# Altium schematic sheet PWM_CONTROLLER_nverter_540VDC_V2.SchDoc
size A0; SheetNumber: 1; SheetTotal: 1; SPICEModelCacheYQEDCYZF: <root> / <DocumentId>YQEDCYZF</DocumentId> / <CacheFrame Number="0"> / <Model Name="7850_74477530_1m" Kind="CKT"> / <Text>******* / .subckt 7850_74477530_1m 1 2 / Rp 1 2 187304.915771 / Cp 1 2 4.36976277949p / Rs 1 N3 3.3 / L1 N3 2 1000u / .ends 7850_74477530_1m</Text> / </Model> / </CacheFrame> / </root>
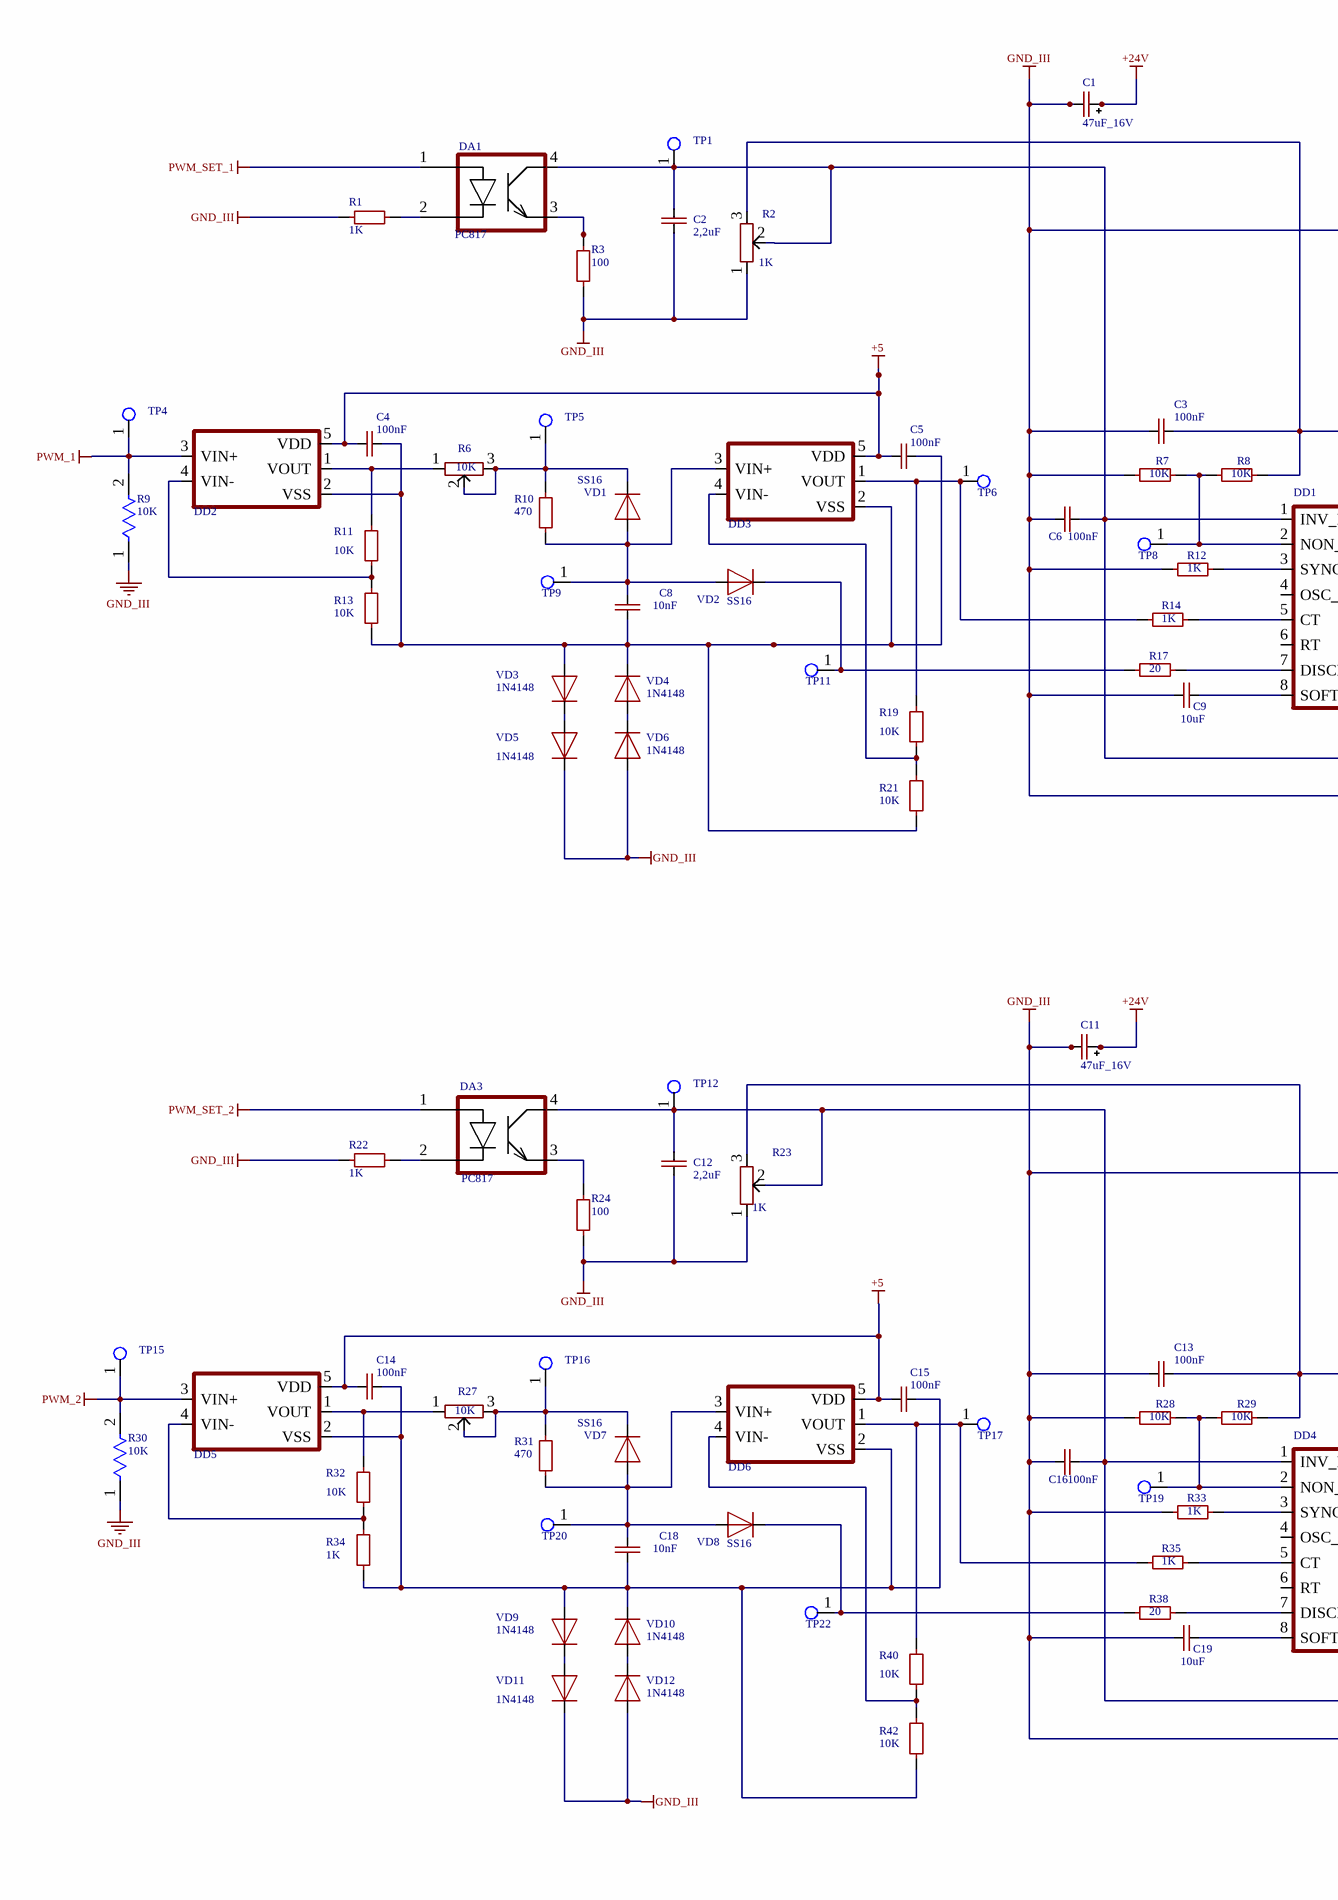
[diagram p0: PWM_CONTROLLER_nverter_540VDC_V2.SchDoc, top left]
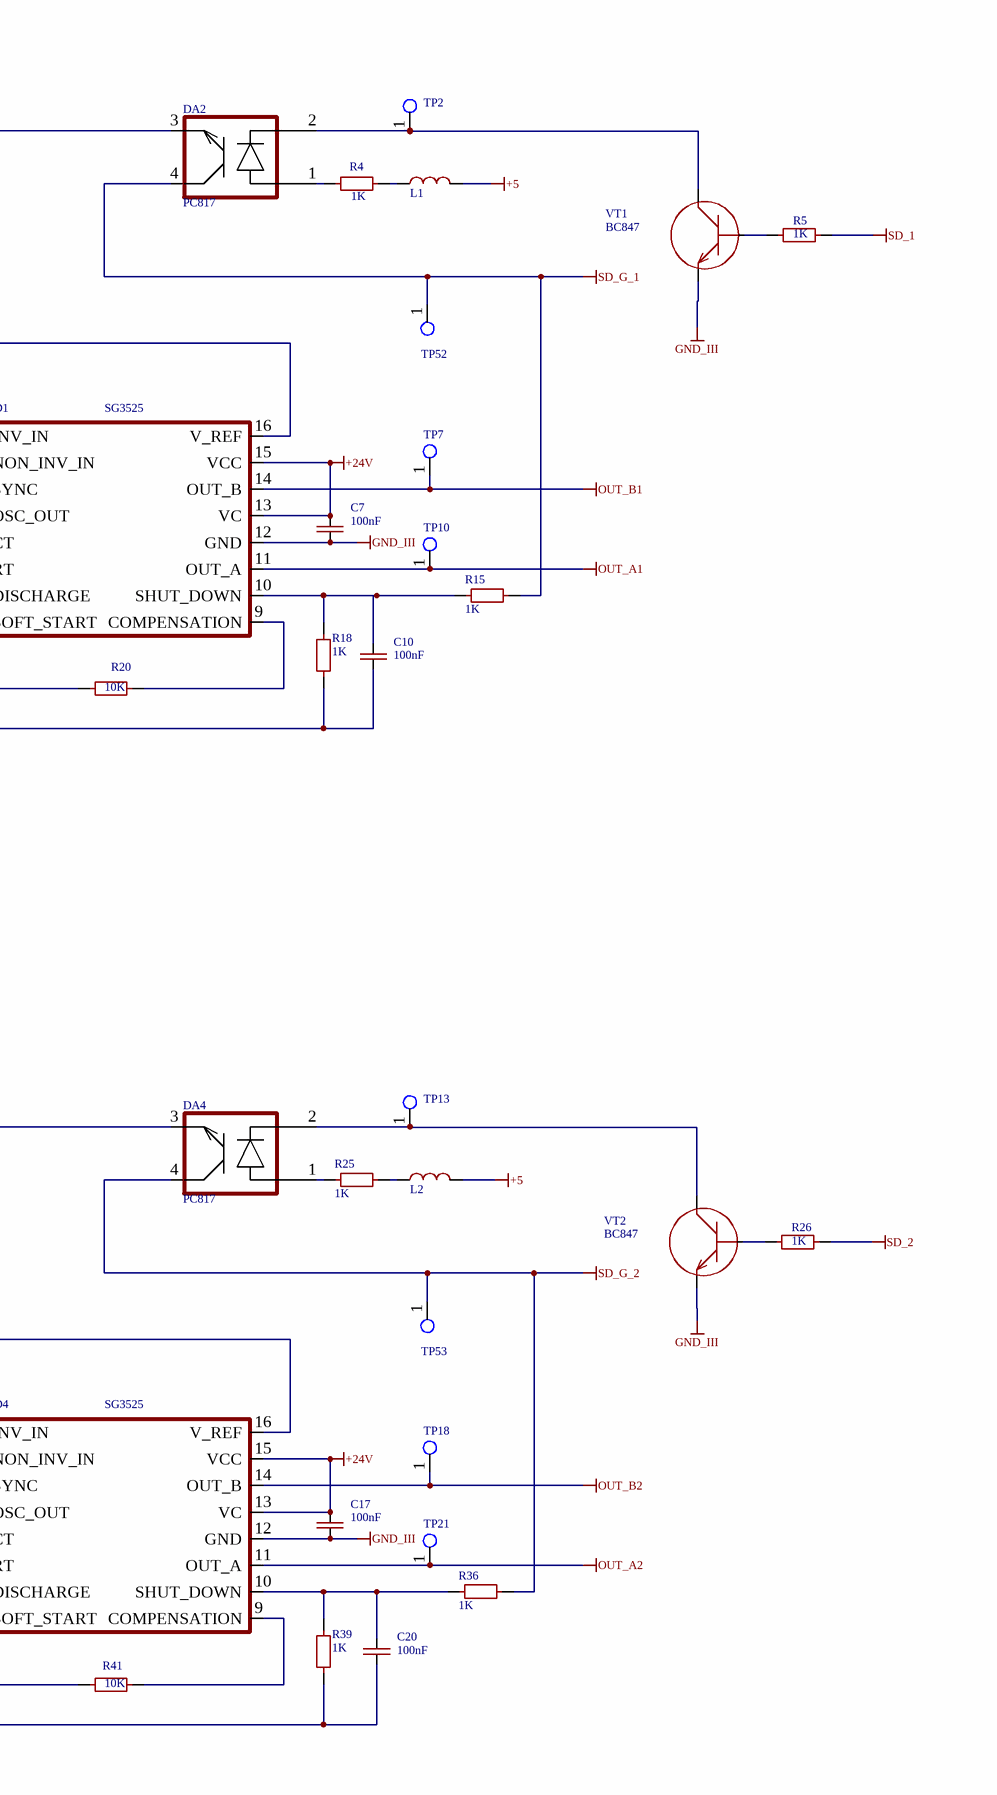
[diagram p1: PWM_CONTROLLER_nverter_540VDC_V2.SchDoc, top right]
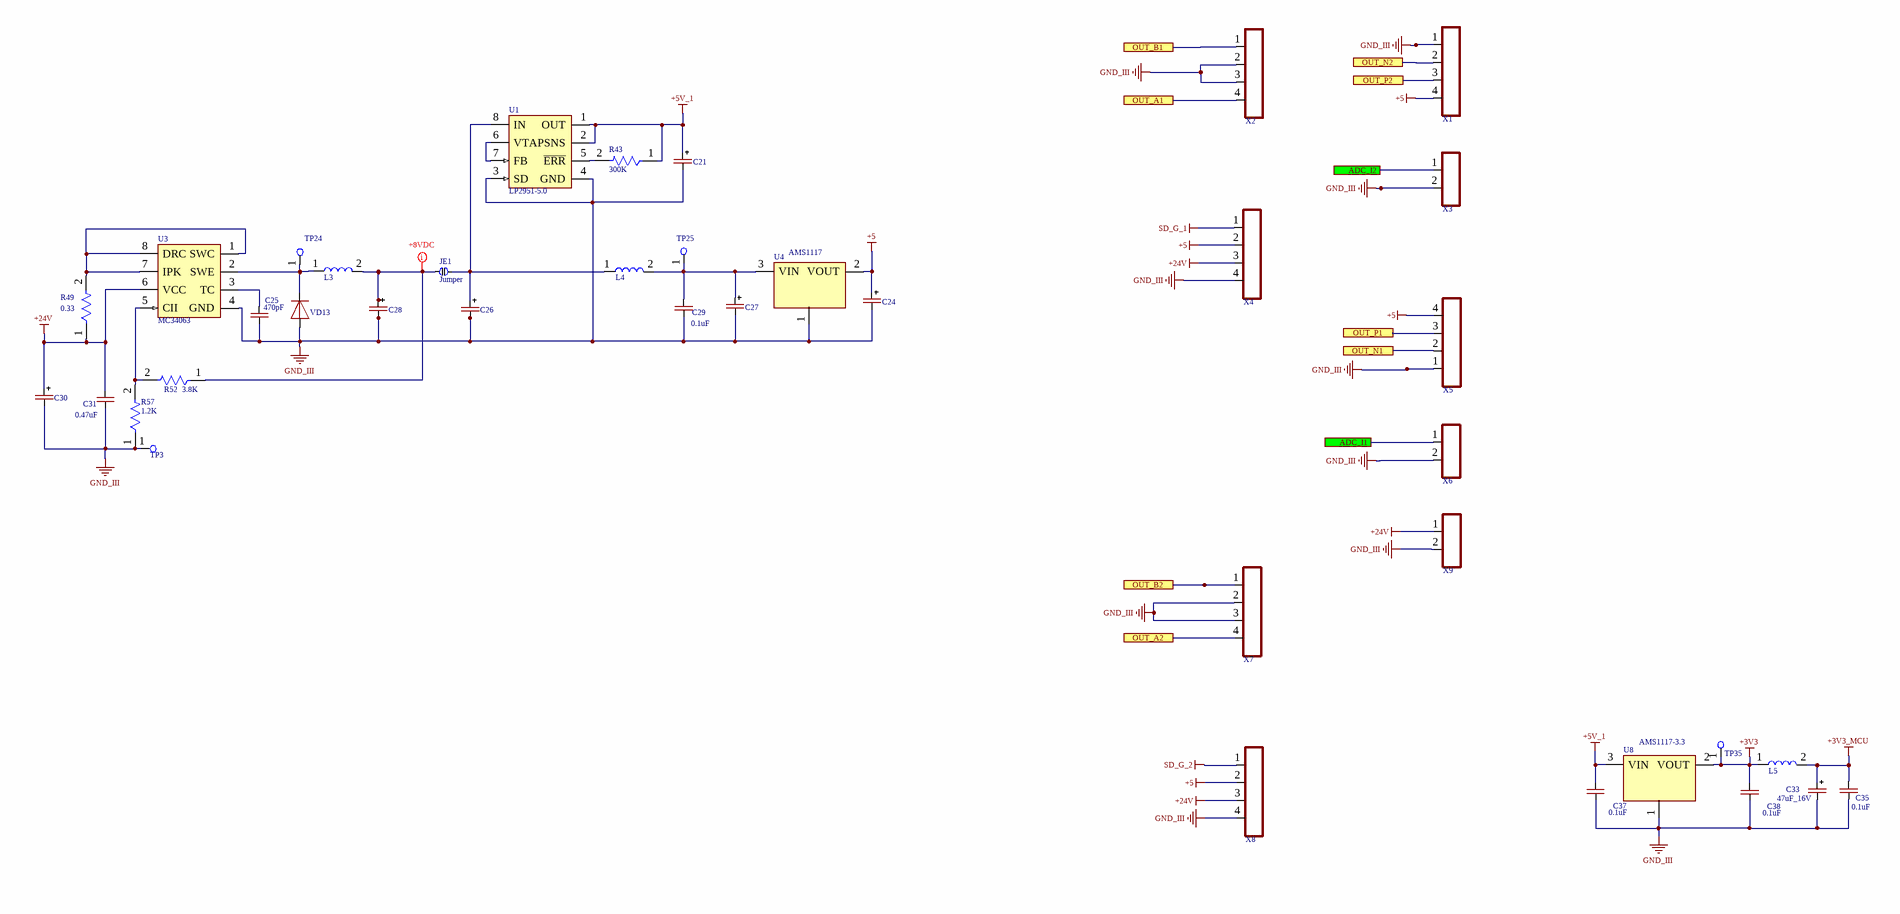
[diagram p2: PWM_CONTROLLER_nverter_540VDC_V2.SchDoc, bottom left]
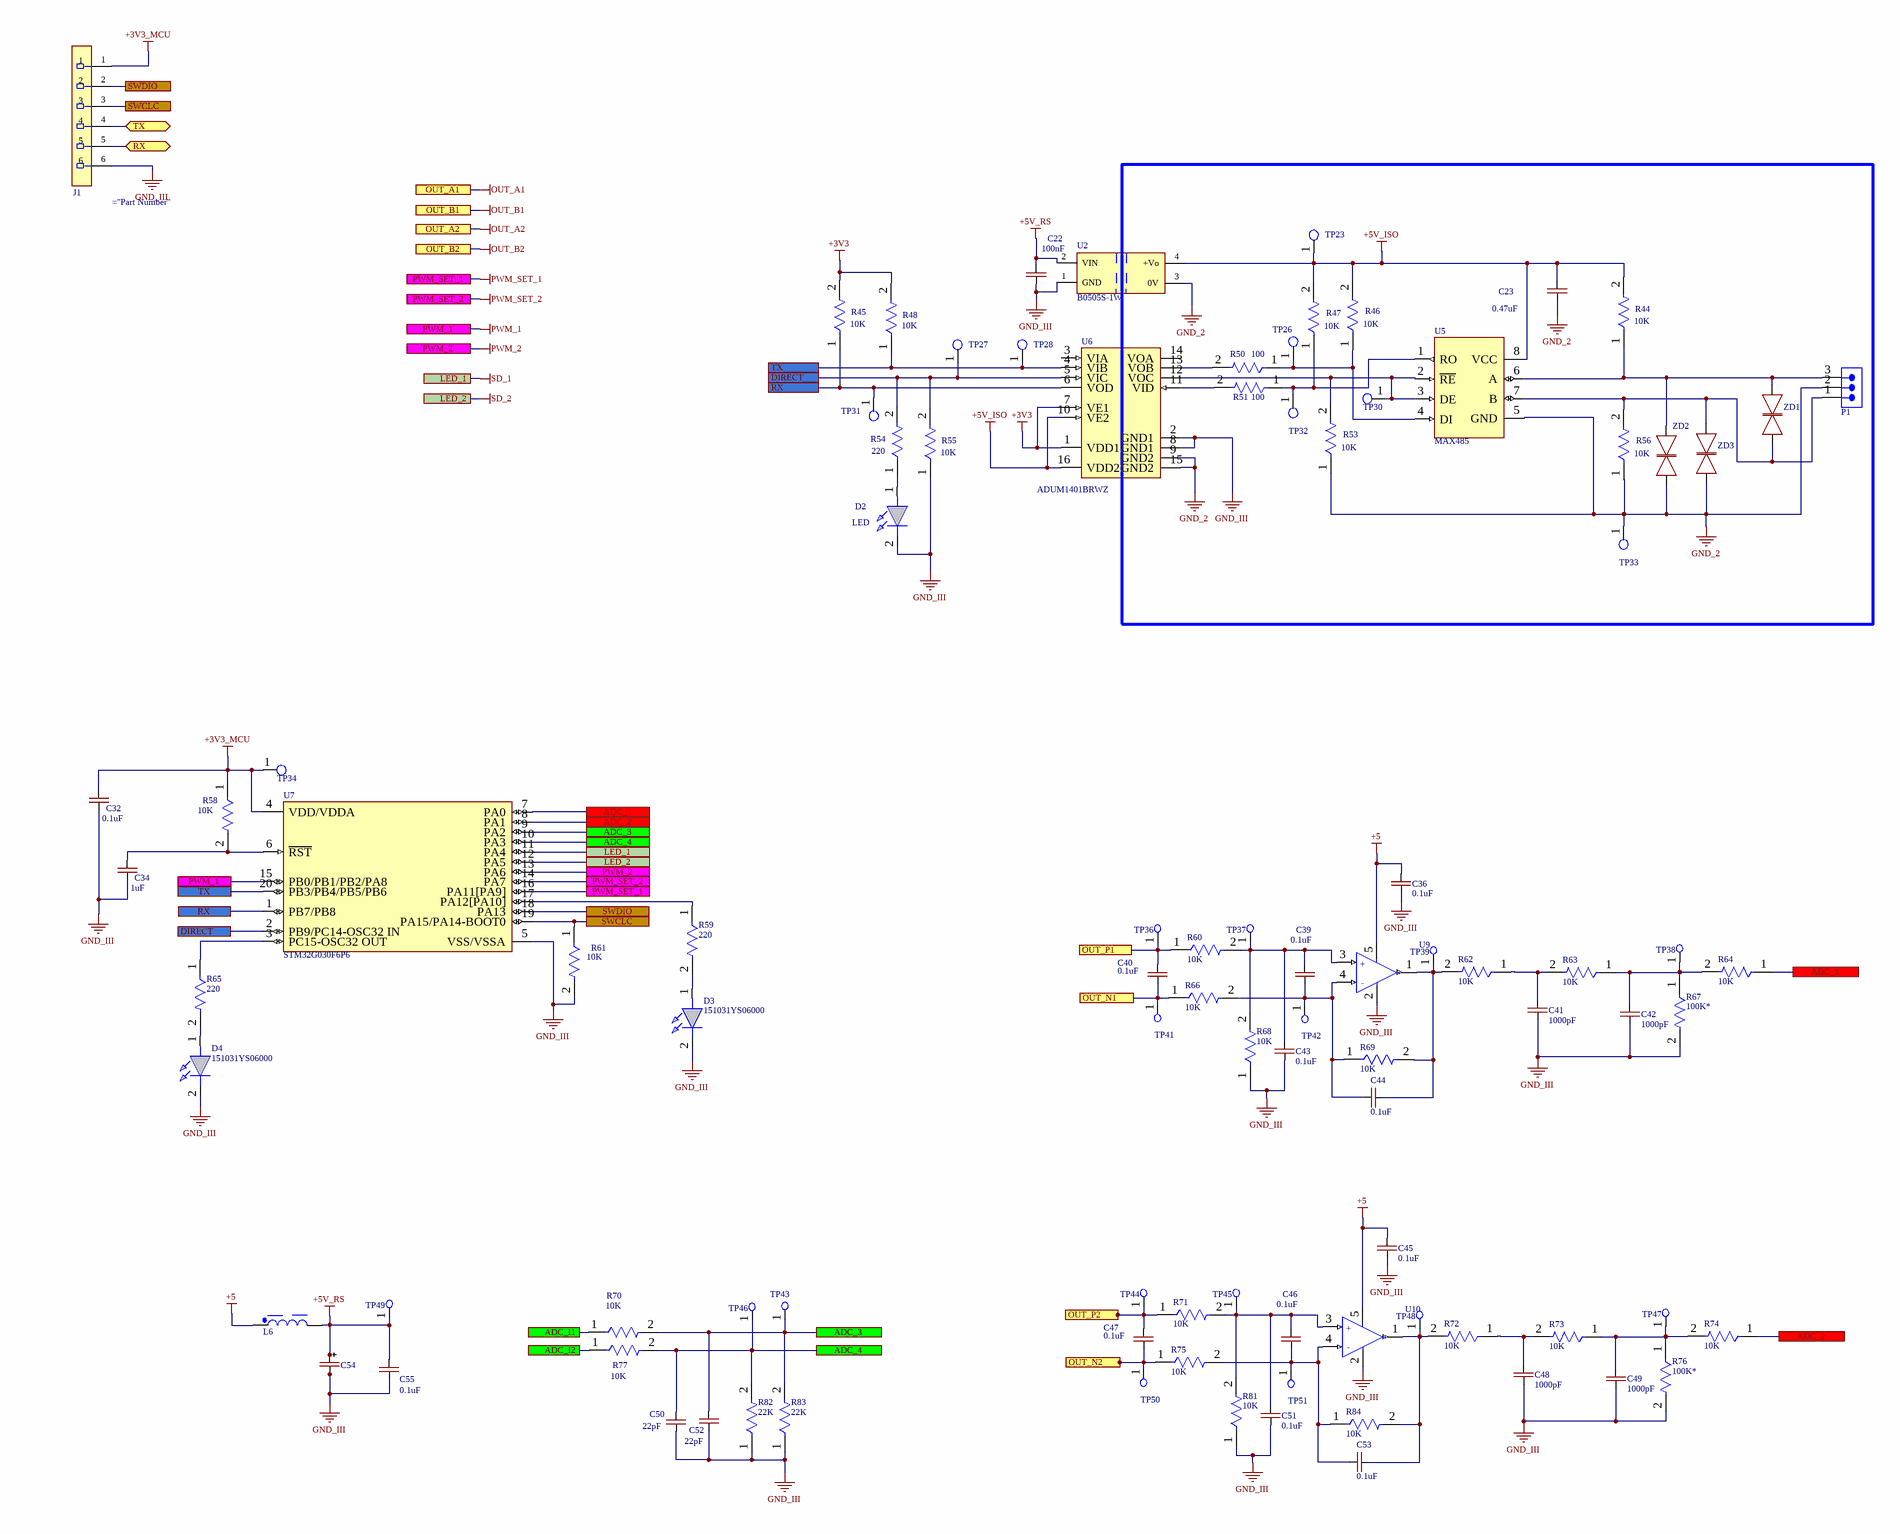
[diagram p3: PWM_CONTROLLER_nverter_540VDC_V2.SchDoc, bottom right]

## Parts
C1  47uF_16V  [CAP-TAN-D]
C2  2,2uF  [CAP-0805]
C3  100nF  [CAP-0805]
C4  100nF  [CAP-0805]
C5  100nF  [CAP-0805]
C6  100nF  [CAP-0805]
C7  100nF  [CAP-0805]
C8  10nF  [CAP-0805]
C9  10uF  [CAP-0805]
C10  100nF  [CAP-0805]
C11  47uF_16V  [CAP-TAN-D]
C12  2,2uF  [CAP-0805]
C13  100nF  [CAP-0805]
C14  100nF  [CAP-0805]
C15  100nF  [CAP-0805]
C16  100nF  [CAP-0805]
C17  100nF  [CAP-0805]
C18  10nF  [CAP-0805]
C19  10uF  [CAP-0805]
C20  100nF  [CAP-0805]
C21  CAP-POLAR  [CAP-TAN-C]  (value not drawn)
C22  100nF  [CAP-0805]
C23  0.47uF  [CAP-0805]
C24  CAP-POLAR  [CAP-TAN-C]  (value not drawn)
C25  470pF  [CAP-0805]
C26  CAP-POLAR  [CAP-TAN-C]  (value not drawn)
C27  CAP-POLAR  [CAP-TAN-C]  (value not drawn)
C28  CAP-POLAR  [CAP-TAN-C]  (value not drawn)
C29  0.1uF  [CAP-0805]
C30  CAP-POLAR  [CAP-TAN-C]  (value not drawn)
C31  0.47uF  [CAP-0805]
C32  0.1uF  [CAP-0805]
C33  47uF_16V  [CAP-TAN-D]
C34  1uF  [CAP-0805]
C35  0.1uF  [CAP-0805]
C36  0.1uF  [CAP-0805]
C37  0.1uF  [CAP-0805]
C38  0.1uF  [CAP-0805]
C39  0.1uF  [CAP-0805]
C40  0.1uF  [CAP-0805]
C41  1000pF  [CAP-0805]
C42  1000pF  [CAP-0805]
C43  0.1uF  [CAP-0805]
C44  0.1uF  [CAP-0805]
C45  0.1uF  [CAP-0805]
C46  0.1uF  [CAP-0805]
C47  0.1uF  [CAP-0805]
C48  1000pF  [CAP-0805]
C49  1000pF  [CAP-0805]
C50  22pF  [CAP-0805]
C51  0.1uF  [CAP-0805]
C52  22pF  [CAP-0805]
C53  0.1uF  [CAP-0805]
C54  CAP-POLAR  [CAP-TAN-C]  (value not drawn)
C55  0.1uF  [CAP-0805]
D2  LED  [LED_RED]
D3  151031YS06000  [LED_RED]
D4  151031YS06000  [LED_RED]
DA1  PC817  [4-SMD]
DA2  PC817  [4-SMD]
DA3  PC817  [4-SMD]
DA4  PC817  [4-SMD]
DD1  SG3525  [SO16-150]
DD2  MCP6001  [SOT23-5]  (value not drawn)
DD3  MCP6001  [SOT23-5]  (value not drawn)
DD4  SG3525  [SO16-150]
DD5  MCP6001  [SOT23-5]  (value not drawn)
DD6  MCP6001  [SOT23-5]  (value not drawn)
J1  SWR25X-NRTC-S06-ST-BA  [Sullins_SWR25X-NRTC-S06-ST-BA_MFG]  (value not drawn)
JE1  Jumper  [JE]
L1  IND-CONST  [IND-5852]  (value not drawn)
L2  IND-CONST  [IND-5852]  (value not drawn)
L3  Coil  [Coil_4.5x4.5_mm]  (value not drawn)
L4  Coil  [Coil_4.5x4.5_mm]  (value not drawn)
L5  Coil  [Coil_4.5x4.5_mm]  (value not drawn)
L6  1000µH, 0.3A  [WE-PD2_7850]  (value not drawn)
P1  691701530003B  [691701530003B]  (value not drawn)
R1  1K  [RES-0805]
R2  1K  [3296W]
R3  100  [RES-0805]
R4  1K  [RES-0805]
R5  1K  [RES-0805]
R6  10K  [3296W]
R7  10K  [RES-0805]
R8  10K  [RES-0805]
R9  10K  [RES-0805]
R10  470  [RES-0805]
R11  10K  [RES-0805]
R12  1K  [RES-0805]
R13  10K  [RES-0805]
R14  1K  [RES-0805]
R15  1K  [RES-0805]
R17  20  [RES-0805]
R18  1K  [RES-0805]
R19  10K  [RES-0805]
R20  10K  [RES-0805]
R21  10K  [RES-0805]
R22  1K  [RES-0805]
R23  1K  [3296W]
R24  100  [RES-0805]
R25  1K  [RES-0805]
R26  1K  [RES-0805]
R27  10K  [3296W]
R28  10K  [RES-0805]
R29  10K  [RES-0805]
R30  10K  [RES-0805]
R31  470  [RES-0805]
R32  10K  [RES-0805]
R33  1K  [RES-0805]
R34  1K  [RES-0805]
R35  1K  [RES-0805]
R36  1K  [RES-0805]
R38  20  [RES-0805]
R39  1K  [RES-0805]
R40  10K  [RES-0805]
R41  10K  [RES-0805]
R42  10K  [RES-0805]
R43  300K  [RES-0805]
R44  10K  [RES-0805]
R45  10K  [RES-0805]
R46  10K  [RES-0805]
R47  10K  [RES-0805]
R48  10K  [RES-0805]
R49  0.33  [RES-1206]
R50  100  [RES-0805]
R51  100  [RES-0805]
R52  3.8K  [RES-0805]
R53  10K  [RES-0805]
R54  220  [RES-0805]
R55  10K  [RES-0805]
R56  10K  [RES-0805]
R57  1.2K  [RES-0805]
R58  10K  [RES-0805]
R59  220  [RES-0805]
R60  10K  [RES-0805]
R61  10K  [RES-0805]
R62  10K  [RES-0805]
R63  10K  [RES-0805]
R64  10K  [RES-0805]
R65  220  [RES-0805]
R66  10K  [RES-0805]
R67  100K*  [RES-0805]
R68  10K  [RES-0805]
R69  10K  [RES-0805]
R70  10K  [RES-0805]
R71  10K  [RES-0805]
R72  10K  [RES-0805]
R73  10K  [RES-0805]
R74  10K  [RES-0805]
R75  10K  [RES-0805]
R76  100K*  [RES-0805]
R77  10K  [RES-0805]
R81  10K  [RES-0805]
R82  22K  [RES-0805]
R83  22K  [RES-0805]
R84  10K  [RES-0805]
TP1  Test_Point_PCB  [Test_Point]  (value not drawn)
TP2  Test_Point_PCB  [Test_Point]  (value not drawn)
TP3  Test_Point_PCB  [Test_Point]  (value not drawn)
TP4  Test_Point_PCB  [Test_Point]  (value not drawn)
TP5  Test_Point_PCB  [Test_Point]  (value not drawn)
TP6  Test_Point_PCB  [Test_Point]  (value not drawn)
TP7  Test_Point_PCB  [Test_Point]  (value not drawn)
TP8  Test_Point_PCB  [Test_Point]  (value not drawn)
TP9  Test_Point_PCB  [Test_Point]  (value not drawn)
TP10  Test_Point_PCB  [Test_Point]  (value not drawn)
TP11  Test_Point_PCB  [Test_Point]  (value not drawn)
TP12  Test_Point_PCB  [Test_Point]  (value not drawn)
TP13  Test_Point_PCB  [Test_Point]  (value not drawn)
TP15  Test_Point_PCB  [Test_Point]  (value not drawn)
TP16  Test_Point_PCB  [Test_Point]  (value not drawn)
TP17  Test_Point_PCB  [Test_Point]  (value not drawn)
TP18  Test_Point_PCB  [Test_Point]  (value not drawn)
TP19  Test_Point_PCB  [Test_Point]  (value not drawn)
TP20  Test_Point_PCB  [Test_Point]  (value not drawn)
TP21  Test_Point_PCB  [Test_Point]  (value not drawn)
TP22  Test_Point_PCB  [Test_Point]  (value not drawn)
TP23  Test_Point_PCB  [Test_Point]  (value not drawn)
TP24  Test_Point_PCB  [Test_Point]  (value not drawn)
TP25  Test_Point_PCB  [Test_Point]  (value not drawn)
TP26  Test_Point_PCB  [Test_Point]  (value not drawn)
TP27  Test_Point_PCB  [Test_Point]  (value not drawn)
TP28  Test_Point_PCB  [Test_Point]  (value not drawn)
TP30  Test_Point_PCB  [Test_Point]  (value not drawn)
TP31  Test_Point_PCB  [Test_Point]  (value not drawn)
TP32  (no value)  [Test_Point]
TP33  Test_Point_PCB  [Test_Point]  (value not drawn)
TP34  (no value)  [Test_Point]
TP35  Test_Point_PCB  [Test_Point]  (value not drawn)
TP36  Test_Point_PCB  [Test_Point]  (value not drawn)
TP37  Test_Point_PCB  [Test_Point]  (value not drawn)
TP38  Test_Point_PCB  [Test_Point]  (value not drawn)
TP39  Test_Point_PCB  [Test_Point]  (value not drawn)
TP41  Test_Point_PCB  [Test_Point]  (value not drawn)
TP42  Test_Point_PCB  [Test_Point]  (value not drawn)
TP43  Test_Point_PCB  [Test_Point]  (value not drawn)
TP44  Test_Point_PCB  [Test_Point]  (value not drawn)
TP45  Test_Point_PCB  [Test_Point]  (value not drawn)
TP46  Test_Point_PCB  [Test_Point]  (value not drawn)
TP47  Test_Point_PCB  [Test_Point]  (value not drawn)
TP48  Test_Point_PCB  [Test_Point]  (value not drawn)
TP49  Test_Point_PCB  [Test_Point]  (value not drawn)
TP50  Test_Point_PCB  [Test_Point]  (value not drawn)
TP51  Test_Point_PCB  [Test_Point]  (value not drawn)
TP52  Test_Point_PCB  [Test_Point]  (value not drawn)
TP53  Test_Point_PCB  [Test_Point]  (value not drawn)
U1  LP2951-5.0  [SOIC-8_L]
U2  B0505S-1W  [B0505S-1W]
U3  MC34063  [SOIC-8_M]
U4  AMS1117  [SOT-89]
U5  MAX485  [SOIC-8-MFG]
U6  ADUM1401BRWZ  [ADI-RW-16_M]
U7  STM32G030F6P6  [FP-TSSOP20-YA-IPC_A]
U8  AMS1117-3.3  [SOT-223]
U9  (no value)  [SOT-23-5]
U10  (no value)  [SOT-23-5]
VD1  SS16  [DO-214AC, SMA]
VD2  SS16  [DO-214AC, SMA]
VD3  1N4148  [SOD-123]
VD4  1N4148  [SOD-123]
VD5  1N4148  [SOD-123]
VD6  1N4148  [SOD-123]
VD7  SS16  [DO-214AC, SMA]
VD8  SS16  [DO-214AC, SMA]
VD9  1N4148  [SOD-123]
VD10  1N4148  [SOD-123]
VD11  1N4148  [SOD-123]
VD12  1N4148  [SOD-123]
VD13  DIODE  [DO-214AC, SMA]  (value not drawn)
VT1  BC847  [SOT23-3]
VT2  BC847  [SOT23-3]
X1  CONN-4-PIN  [CONN-PLS-4-2.54mm_1]  (value not drawn)
X2  CONN-4-PIN  [CONN-PLS-4-2.54mm_1]  (value not drawn)
X3  CONN-2-PIN  [XH2-]  (value not drawn)
X4  CONN-4-PIN  [CONN-PLS-4-2.54mm_1]  (value not drawn)
X5  CONN-4-PIN  [CONN-PLS-4-2.54mm_1]  (value not drawn)
X6  CONN-2-PIN  [XH2-]  (value not drawn)
X7  CONN-4-PIN  [CONN-PLS-4-2.54mm_1]  (value not drawn)
X8  CONN-4-PIN  [CONN-PLS-4-2.54mm_1]  (value not drawn)
X9  CONN-2-PIN  [XH2-]  (value not drawn)
ZD1  P6SMB16CA  [DO-214AA]  (value not drawn)
ZD2  P6SMB16CA  [DO-214AA]  (value not drawn)
ZD3  P6SMB16CA  [DO-214AA]  (value not drawn)

## Ports
ADC_1, ADC_2, ADC_3, ADC_4, ADC_I1, ADC_I2, DIRECT, LED_1, LED_2, OUT_A1, OUT_A2, OUT_B1, OUT_B2, OUT_N1, OUT_N2, OUT_P1, OUT_P2, PWM_1, PWM_2, PWM_SET_1, PWM_SET_2, RX, RX (bidir), SWCLC, SWDIO, TX, TX (bidir)

## Nets
+3V3: C38.2 L5.1 R45.2 R48.2 TP35.1(G9) U6.1(VDD1) U6.7(VE1) U8.2(VOUT)
+3V3_MCU: C32.2 C33.1(+) C35.2 J1.1 L5.2 R58.1 TP34.1(G9) U7.4(VDD/VDDA)
+5: C4.2 C5.2 C14.2 C15.2 C24.1(+) C36.2 C45.2 DD2.5(VDD) DD3.5(VDD) DD5.5(VDD) DD6.5(VDD) L1.2 L2.2 L6.1 U4.2(VOUT) U9.5(VDD) U10.5(VDD) X1.4 X4.2 X5.4 X8.2
+5V_1: C21.1(+) C37.2 R43.1 U1.1(OUT) U1.2(SNS) U8.3(VIN)
+5V_ISO: C23.1 R44.2 R46.2 R47.2 TP23.1(G9) U2.4(+Vo) U5.8(VCC) U6.10(VE2) U6.16(VDD2)
+5V_RS: C22.2 C54.1(+) C55.2 L6.2 TP49.1(G9) U2.2(VIN)
+24V: C1.1(+) C7.2 C11.1(+) C17.2 C30.1(+) C31.1 DD1.13(VC) DD1.15(VCC) DD4.13(VC) DD4.15(VCC) R49.1 U3.6(VCC) X4.3 X8.3 X9.1
GND_2: C23.2 P1.2 R53.1 R56.1 TP33.1(G9) U2.3(0V) U5.5(GND) U6.9(GND2) U6.15(GND2) ZD2.1(A) ZD3.1(A)
GND_III: C1.2(-) C2.2 C3.2 C6.2 C7.1 C9.2 C10.1 C11.2(-) C12.2 C13.2 C16.2 C17.1 C19.2 C20.1 C21.2(-) C22.1 C24.2(-) C25.2 C26.2(-) C27.2(-) C28.2(-) C29.1 C30.2(-) C31.2 C32.1 C33.2(-) C34.1 C35.1 C36.1 C37.1 C38.1 C41.1 C42.1 C43.1 C45.1 C48.1 C49.1 C50.1 C51.1 C52.1 C54.2(-) C55.1 D2.2(K) D3.2(K) D4.2(K) DA2.3(EMITTER) DA4.3(EMITTER) DD1.12(GND) DD4.12(GND) J1.6 R1.1 R2.1 R3.1 R7.2 R9.1 R12.2 R18.1 R22.1 R23.1 R24.1 R28.2 R30.1 R33.2 R39.1 R55.1 R57.1 R61.2 R67.2 R68.1 R76.2 R81.1 R82.1 R83.1 TP3.1(G9) U1.3(SD) U1.4(GND) U2.1(GND) U3.4(GND) U4.1(Ground) U6.2(GND1) U6.8(GND1) U7.5(VSS/VSSA) U8.1(Ground) U9.2(VSS) U10.2(VSS) VD5.1(C) VD6.2(A) VD11.1(C) VD12.2(A) VD13.2(A) VT1.3(E) VT2.3(E) X1.1 X2.2 X2.3 X3.2 X5.1 X6.2 X7.2 X7.3 X8.4 X9.2
OUT_A1: DD1.11(OUT_A) TP10.1(G9) X2.4 ; port OUT_A1
OUT_A2: DD4.11(OUT_A) TP21.1(G9) X7.4 ; port OUT_A2
OUT_B1: DD1.14(OUT_B) TP7.1(G9) X2.1 ; port OUT_B1
OUT_B2: DD4.14(OUT_B) TP18.1(G9) X7.1 ; port OUT_B2
PWM_1: DD2.3(VIN+) R9.2 TP4.1(G9) U7.15(PB0/PB1/PB2/PA8) ; port PWM_1
PWM_2: DD5.3(VIN+) R30.2 TP15.1(G9) U7.13(PA6) ; port PWM_2
PWM_SET_1: DA1.1(ANODE) U7.16(PA11[PA9]) ; port PWM_SET_1
PWM_SET_2: DA3.1(ANODE) U7.14(PA7) ; port PWM_SET_2
SD_1: R5.1 U7.11(PA4) ; port LED_1
SD_2: R26.1 U7.12(PA5) ; port LED_2
SD_G_1: DA2.4(COLLECTOR) R15.2 TP52.1(G9) X4.1
SD_G_2: DA4.4(COLLECTOR) R36.2 TP53.1(G9) X8.1
ADC_1: R64.1 U7.7(PA0) ; port ADC_1
ADC_2: R74.1 U7.8(PA1) ; port ADC_2
ADC_3: C52.2 R70.2 R83.2 TP43.1(G9) U7.9(PA2) ; port ADC_3
ADC_4: C50.2 R77.2 R82.2 TP46.1(G9) U7.10(PA3) ; port ADC_4
ADC_I1: R70.1 X6.1 ; port ADC_I1
ADC_I2: R77.1 X3.1 ; port ADC_I2
DIRECT: R54.2 R55.2 TP27.1(G9) U6.5(VIC) U7.2(PB9/PC14-OSC32_IN) ; port DIRECT
OUT_N1: C40.1 R66.1 TP41.1(G9) X5.2 ; port OUT_N1
OUT_N2: C47.1 R75.1 TP50.1(G9) X1.2 ; port OUT_N2
OUT_P1: C40.2 R60.1 TP36.1(G9) X5.3 ; port OUT_P1
OUT_P2: C47.2 R71.1 TP44.1(G9) X1.3 ; port OUT_P2
RX: J1.5 R45.1 TP31.1(G9) U6.6(VOD) U7.1(PB7/PB8) ; port RX
SWCLC: J1.3 R61.1 U7.19(PA15/PA14-BOOT0) ; port SWCLC
SWDIO: J1.2 U7.18(PA13) ; port SWDIO
TX: J1.4 R48.1 TP28.1(G9) U6.4(VIB) U7.20(PB3/PB4/PB5/PB6) ; port TX
NetC2_1: C2.1 C6.1 DA1.4(COLLECTOR) DD1.1(INV_IN) R2.2 R20.2 TP1.1(G9)
NetC3_1: C3.1 DD1.16(V_REF) R2.3 R8.1
NetC4_1: C4.1 C5.1 C8.2 DD2.2(VSS) DD3.2(VSS) R13.2 R21.2 VD3.2(A) VD4.1(C)
NetC8_1: C8.1 DD3.3(VIN+) R10.2 TP9.1(G9) VD1.2(A) VD2.2(A)
NetC9_1: C9.1 DD1.8(SOFT_START)
NetC10_2: C10.2 DD1.10(SHUT_DOWN) R15.1 R18.2
NetC12_1: C12.1 C16.1 DA3.4(COLLECTOR) DD4.1(INV_IN) R23.2 R41.2 TP12.1(G9)
NetC13_1: C13.1 DD4.16(V_REF) R23.3 R29.1
NetC14_1: C14.1 C15.1 C18.2 DD5.2(VSS) DD6.2(VSS) R34.2 R42.2 VD9.2(A) VD10.1(C)
NetC18_1: C18.1 DD6.3(VIN+) R31.2 TP20.1(G9) VD7.2(A) VD8.2(A)
NetC19_1: C19.1 DD4.8(SOFT_START)
NetC20_2: C20.2 DD4.10(SHUT_DOWN) R36.1 R39.2
NetC25_1: C25.1 U3.3(TC)
NetC26_1: C26.1(+) JE1.1 L4.1 U1.8(IN)
NetC27_1: C27.1(+) C29.2 L4.2 TP25.1(G9) U4.3(VIN)
NetC28_1: C28.1(+) JE1.2 L3.2 R52.1
NetC34_2: C34.2 R58.2 U7.6(~{RST})
NetC39_1: C39.1 C44.1 R66.2 R69.1 TP42.1(G9) U9.4(VIN-)
NetC39_2: C39.2 C43.2 R60.2 R68.2 TP37.1(G9) U9.3(VIN+)
NetC41_2: C41.2 R62.1 R63.2
NetC42_2: C42.2 R63.1 R64.2 R67.1 TP38.1(G9)
NetC44_2: C44.2 R62.2 R69.2 TP39.1(G9) U9.1(VOUT)
NetC46_1: C46.1 C53.1 R75.2 R84.1 TP51.1(G9) U10.4(VIN-)
NetC46_2: C46.2 C51.2 R71.2 R81.2 TP45.1(G9) U10.3(VIN+)
NetC48_2: C48.2 R72.1 R73.2
NetC49_2: C49.2 R73.1 R74.2 R76.1 TP47.1(G9)
NetC53_2: C53.2 R72.2 R84.2 TP48.1(G9) U10.1(VOUT)
NetD2_1: D2.1(A) R54.1
NetD3_1: D3.1(A) R59.2
NetD4_1: D4.1(A) R65.2
NetDA1_2: DA1.2(CATHODE) R1.2
NetDA1_3: DA1.3(EMITTER) R3.2
NetDA2_1: DA2.1(ANODE) R4.1
NetDA2_2: DA2.2(CATHODE) TP2.1(G9) VT1.2(C)
NetDA3_2: DA3.2(CATHODE) R22.2
NetDA3_3: DA3.3(EMITTER) R24.2
NetDA4_1: DA4.1(ANODE) R25.1
NetDA4_2: DA4.2(CATHODE) TP13.1(G9) VT2.2(C)
NetDD1_2: DD1.2(NON_INV_IN) R7.1 R8.2 TP8.1(G9)
NetDD1_3: DD1.3(SYNC) R12.1
NetDD1_5: DD1.5(CT) R14.1
NetDD1_7: DD1.7(DISCHARGE) R17.1
NetDD1_9: DD1.9(COMPENSATION) R20.1
NetDD2_1: DD2.1(VOUT) R6.1 R11.1
NetDD2_4: DD2.4(VIN-) R11.2 R13.1
NetDD3_1: DD3.1(VOUT) R14.2 R19.1 TP6.1(G9)
NetDD3_4: DD3.4(VIN-) R19.2 R21.1
NetDD4_2: DD4.2(NON_INV_IN) R28.1 R29.2 TP19.1(G9)
NetDD4_3: DD4.3(SYNC) R33.1
NetDD4_5: DD4.5(CT) R35.1
NetDD4_7: DD4.7(DISCHARGE) R38.1
NetDD4_9: DD4.9(COMPENSATION) R41.1
NetDD5_1: DD5.1(VOUT) R27.1 R32.1
NetDD5_4: DD5.4(VIN-) R32.2 R34.1
NetDD6_1: DD6.1(VOUT) R35.2 R40.1 TP17.1(G9)
NetDD6_4: DD6.4(VIN-) R40.2 R42.1
NetL1_1: L1.1 R4.2
NetL2_1: L2.1 R25.2
NetL3_1: L3.1 TP24.1(G9) U3.2(SWE) VD13.1(C)
NetP1_1: P1.1 R56.2 U5.7(B) ZD1.1(A) ZD3.2(A)
NetP1_3: P1.3 R44.1 U5.6(A) ZD1.2(A) ZD2.2(A)
NetR5_2: R5.2 VT1.1(B)
NetR6_2: R6.2 R6.3 R10.1 TP5.1(G9) VD1.1(C)
NetR17_2: R17.2 TP11.1(G9) VD2.1(C)
NetR26_2: R26.2 VT2.1(B)
NetR27_2: R27.2 R27.3 R31.1 TP16.1(G9) VD7.1(C)
NetR38_2: R38.2 TP22.1(G9) VD8.1(C)
NetR43_2: R43.2 U1.5(~{ERR})
NetR46_1: R46.1 R50.1 TP26.1(G9) U5.4(DI)
NetR47_1: R47.1 R51.1 TP32.1(G9) U5.1(RO)
NetR49_2: R49.2 U3.1(SWC) U3.7(IPK) U3.8(DRC)
NetR50_2: R50.2 U6.13(VOB)
NetR51_2: R51.2 U6.11(VID)
NetR52_2: R52.2 R57.2 U3.5(CII)
NetR53_2: R53.2 TP30.1(G9) U5.2(~{RE}) U5.3(DE) U6.12(VOC)
NetR59_1: R59.1 U7.17(PA12[PA10])
NetR65_1: R65.1 U7.3(PC15-OSC32_OUT)
NetU1_6: U1.6(VTAP) U1.7(FB)
NetVD3_1: VD3.1(C) VD5.2(A)
NetVD4_2: VD4.2(A) VD6.1(C)
NetVD9_1: VD9.1(C) VD11.2(A)
NetVD10_2: VD10.2(A) VD12.1(C)

Not connected (* = marked no-connect by the designer): DD1 4(OSC_OUT) 6(RT); DD4 4(OSC_OUT) 6(RT); U6 3(VIA) 14(VOA); X4 4

## Layout directives
mark named +8VDC: (no net found under the mark)

## Notes on the sheet
- (in symbol MCP6001T) +; -

## Library data of the parts
C1 C11 C33 = CAP-POLAR
C2-C10 C12-C20 C22 C23 C25 C29 C31 C32 C34-C53 C55 = CAP-NON-POLAR
D2-D4 = LED: WURTH ELEKTRONIK - 151031YS06000 - LED, Yellow, Through Hole, T-1 (3mm), 30 mA, 2 V, 590 nm; Geometry.Height: 5.5mm; Manufacturer_Name: Wurth Elektronik; Manufacturer_Part_Number: 151031YS06000; Mouser Part Number: 710-151031YS06000; Mouser Price/Stock: https://www.mouser.co.uk/ProductDetail/Wurth-Elektronik/151031YS06000?qs=LlUlMxKIyB3xSYYW%252BcuBiQ%3D%3D; Arrow Part Number: *; Arrow Price/Stock: *; Mouser Testing Part Number: *; Mouser Testing Price/Stock: *; Datasheet Link: https://katalog.we-online.de/led/datasheet/151031YS06000.pdf
JE1 = JE
L6 = 74477530: WE-PD2 SMT Power Inductor, size 7850, 1000µH, 0.3A, 3.3Ω; Manufacturer: Wurth Elektronik; Case/Size Code: 7850; DC Resistance: 2.78Ω; Self Resonant Frequency: 2.4MHz; Manufacturer Part Number: 74477530; Category: Unshielded Power Inductors; Match Code: WE-PD2; ComponentLink1Description: Website Link; ComponentLink1URL: https://www.we-online.com/redexpert/article/74477530?ad; ComponentLink2Description: Datasheet Link; ComponentLink2URL: https://www.we-online.com/redexpert/spec/74477530?ad; Mount: Surface Mount; Operating Temperature Max: 125°C; Operating Temperature Min: -40°C; Packaging: Tape and Reel; Length: 7.8mm; Width: 7mm; Height: 4.95mm; DC Resistance Max: 3.3Ω; Inductance: 1000µH; Rated Current: 0.3A; Saturation Current: 0.3A
P1 = 691701530003B: WR-TBL Series 7015B Open Horizontal PCB Header, SMT, pitch 5.08mm, 3p; Manufacturer: Wurth Elektronik; Modularity: No; Rated Current: 10A; Working Voltage: 300V; ComponentLink1Description: Website Link; ComponentLink1URL: https://www.we-online.com/redexpert/article/691701530003B?ad; ComponentLink2Description: Datasheet Link; ComponentLink2URL: https://www.we-online.com/redexpert/spec/691701530003B?ad; Manufacturer Part Number: 691701530003B; Category: Terminal Blocks; Match Code: WR-TBL; Mount: Surface Mount; Operating Temperature Max: 105°C; Operating Temperature Min: -40°C; Packaging: Box; Application: Pluggable; Number of Pins: 3; Number of Rows: 1; Orientation: Horizontal; Pitch: 5.08mm
R1 R22 R34 R52 = RES-CONST: 10K
R2 R6 R27 = 3296
R3-R5 R7-R15 R18-R21 R24-R26 R28-R33 R35 R36 R39-R51 R53-R77 R81-R84 = RES-CONST
R17 R38 = RES-CONST: 1K
R23 = 3296W
TP1-TP13 TP15-TP28 TP30-TP39 TP41-TP53 = TP_PCB?: Test_Point
U1 = LP2951-3.3
U6 = CMP-0534-00565-1: Quad Channel Digital Isolator, 2.5 KV rms Insulation Rating, 10 Mbps Data Rate, 50 ns Delay, Industrial, 16-pin SOIC (RW-16), Tube; Manufacturer: Analog Devices; Max Data Rate: 10Mbps; ComponentLink2URL: http://www.analog.com/static/imported-files/data_sheets/ADuM1400_1401_1402.pdf; ComponentLink5Description: URL Link2; ComponentLink3URL: http://www.analog.com/static/imported-files/packages/PKG_PDF/SOIC_WIDE%20%28RW%29/RW_16.pdf; DatasheetVersion: Rev. H; ComponentLink2Description: Datasheet; ComponentLink3Description: Package Specification; PartNumber: ADUM1401BRWZ; ComponentLink5URL: Reference Circuit:http://www.analog.com/en/interface-isolation/digital-isolators/adum1401/products/product.html#product-recommendations; Max Operating Temp (degreesC): 125; PackageReference: RW-16; PackageVersion: 032707-B, 03/2007; ComponentLink1Description: Manufacturer URL; Code_JEDEC: MS-013-AA; PackageDescription: 16-Pin Standard Small Outline Package, Body 10.3 x 7.5 mm, Pitch 1.27 mm; Mounting Technology: Surface Mount; ComponentLink1URL: http://www.analog.com/en/index.html; ComponentLink4Description: URL Link1; ComponentLink4URL: Product URL:http://www.analog.com/en/interface-isolation/digital-isolators/adum1401/products/product.html
U7 = STM32G030F6P6: SOIC-20
U8 = AMS1117
U9 U10 = MCP6001T: IC OPAMP GP 1 CIRCUIT SOT23-5; Number of Amplifiers: 1; Voltage: 6V; Power Supply Rejection Ratio (PSRR): 86dB; Common Mode Rejection Ratio: 60dB; Unity Gain Bandwidth Product: 1MHz; Slew Rate: 0.6V/µs; Output Current per Channel: 23mA; Nominal Supply Current: 100uA; Input Offset Voltage (Vos): 4.5mV; Input Bias Current: 1pA; Operating Supply Voltage: 5.5V; Min Supply Voltage: 1.8V; Voltage Gain: 112dB; Length: 3.1mm; REACH SVHC: No SVHC; Number of Pins: 5; Package Quantity: 1; Radiation Hardening: No; Mount: Surface Mount; Number of Circuits: 1; Number of Elements: 1; Output Current: 23mA; Packaging: Tape and Reel; Height: 1.3mm; Lead Free: Lead Free; Min Operating Temperature: -40°C; Bandwidth: 1MHz; Contact Plating: Tin; Max Supply Voltage: 6V; Max Operating Temperature: 85°C; Width: 1.8mm; Case/Package: SOT-23; Operating Supply Current: 100uA; Number of Channels: 1; Gain Bandwidth Product: 1MHz
VD1-VD12 = DIODE
VT1 VT2 = BIPOLAR-NPN-BEC